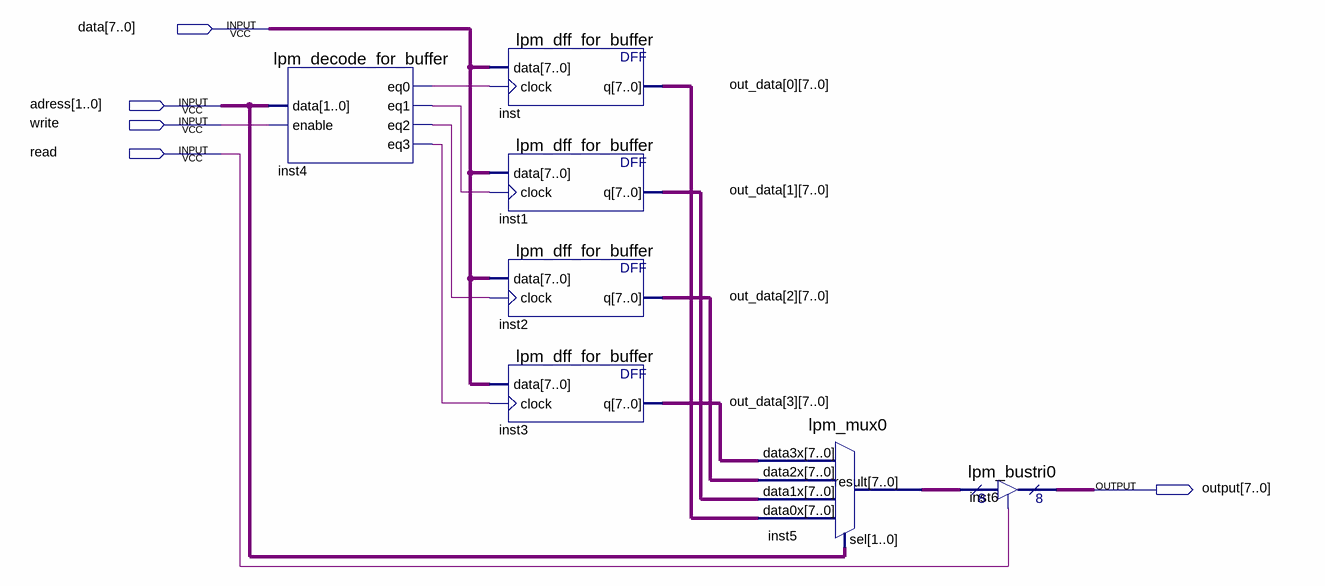
[diagram p0: schematic sheet]
// Quartus schematic bufer.bdf as structural Verilog: 7 symbols, 5 pins
module bufer (
  input  [7:0] data,
  input  [1:0] adress,
  input  write,
  input  read,
  output [7:0] \output 
);

  wire inst4_eq0, inst4_eq1, inst4_eq2, inst4_eq3;
  wire [7:0] inst5_result, out_data_0, out_data_1, out_data_2, out_data_3;

  lpm_decode_for_buffer inst4 (
    .data(adress), .enable(write), .eq0(inst4_eq0), .eq1(inst4_eq1), .eq2(inst4_eq2), .eq3(inst4_eq3));
  lpm_dff_for_buffer inst (.data(data), .clock(inst4_eq0), .q(out_data_0));
  lpm_dff_for_buffer inst1 (.data(data), .clock(inst4_eq1), .q(out_data_1));
  lpm_dff_for_buffer inst2 (.data(data), .clock(inst4_eq2), .q(out_data_2));
  lpm_dff_for_buffer inst3 (.data(data), .clock(inst4_eq3), .q(out_data_3));
  lpm_mux0 inst5 (
    .data3x(out_data_3), .data2x(out_data_2), .data1x(out_data_1), .data0x(out_data_0), .sel(adress),
    .result(inst5_result));
  lpm_bustri0 inst6 (.enabledt(read), .data(inst5_result), .tridata(\output ));
endmodule
